# EAGLE design 4aw (EAGLE 9.6.2)
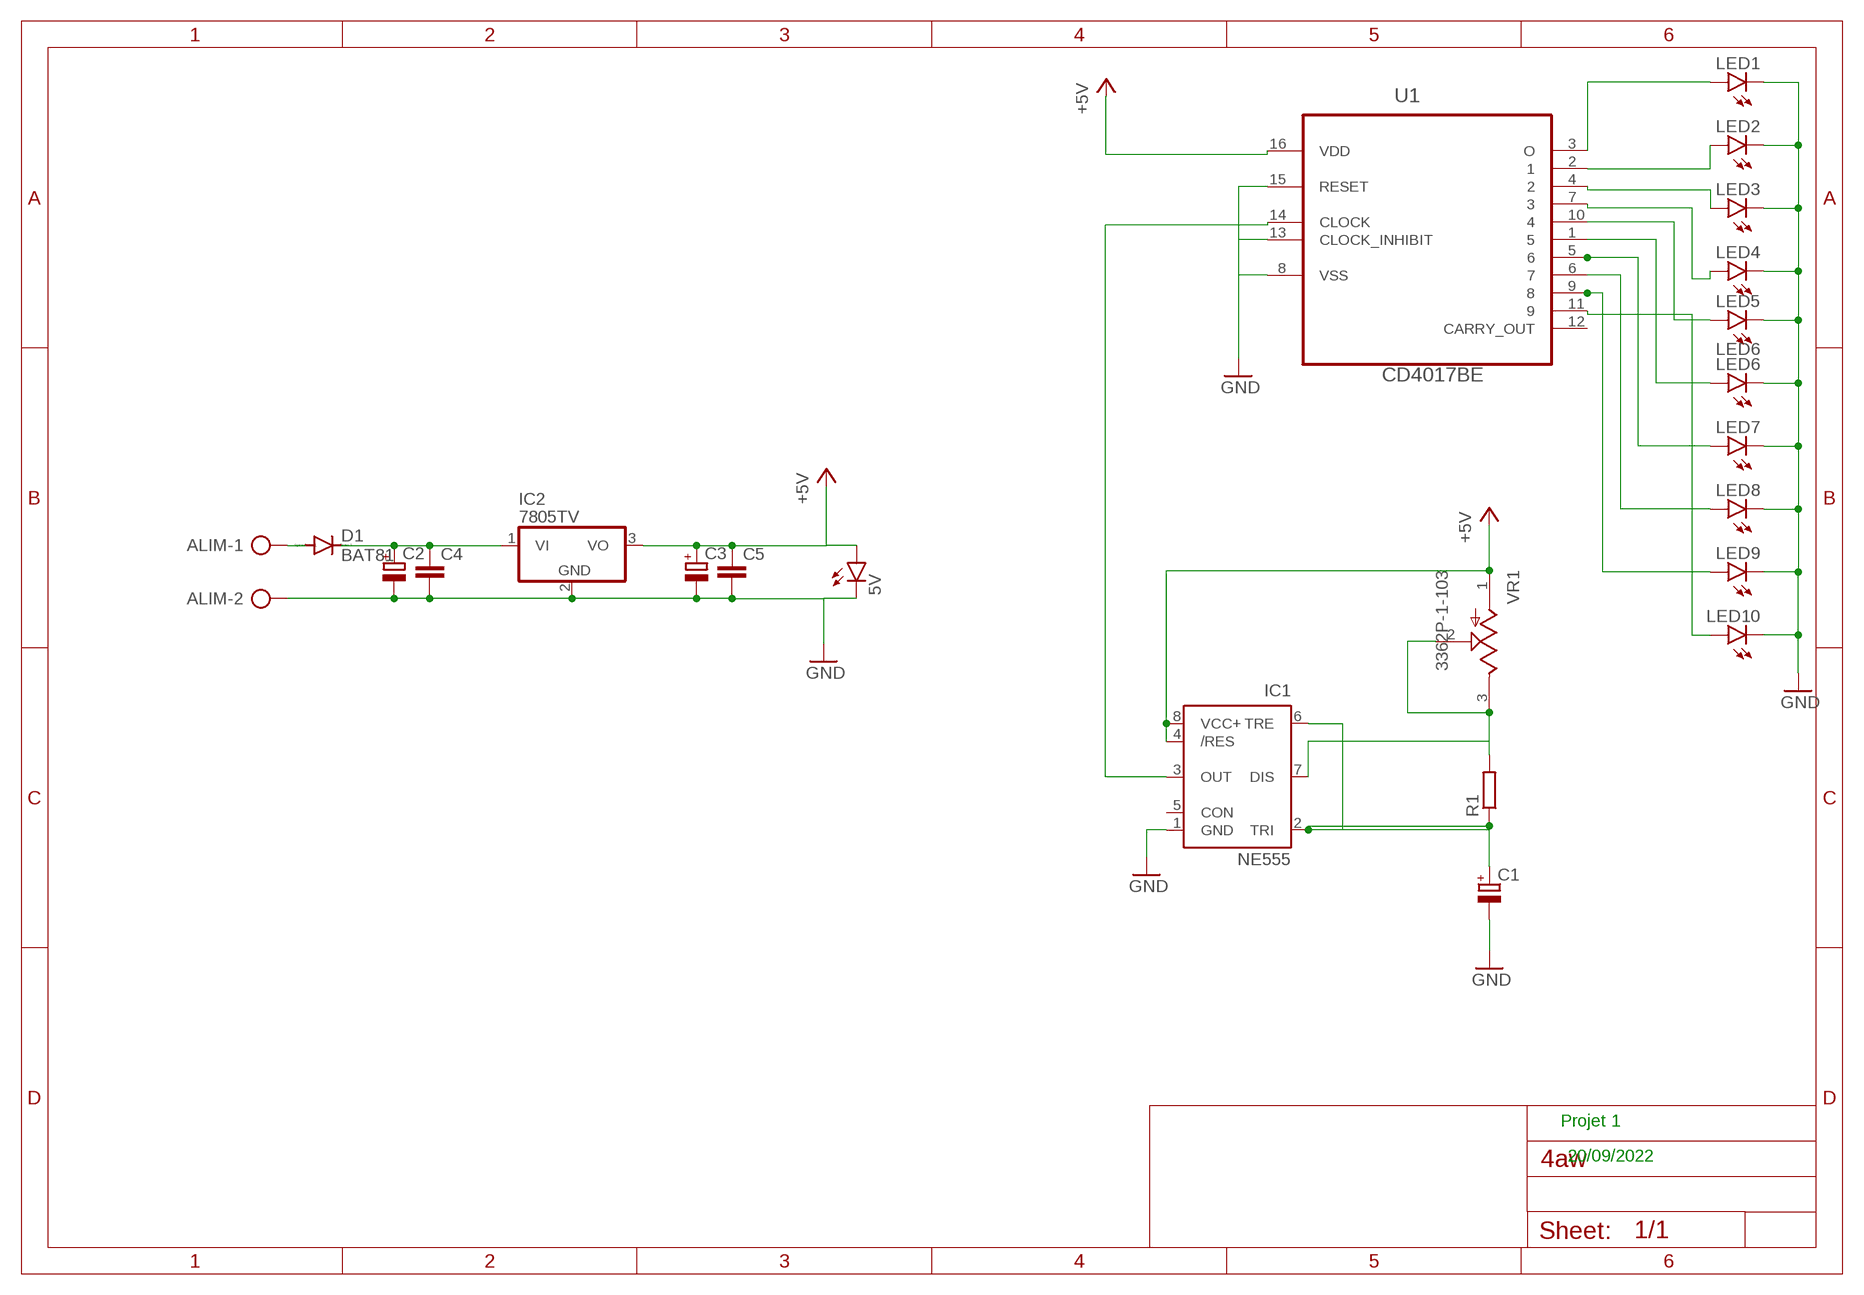
[diagram p0: schematic, sheet 1]

## Parts
5V  LED3MM  [LED3MM]
ALIM  AK500/2  [AK500/2]
C1  CPOL-EUE2.5-5  [E2,5-5]
C2  CPOL-EUE2.5-5  [E2,5-5]
C3  CPOL-EUE2.5-5  [E2,5-5]
C4  C-EU050-024X044  [C050-024X044]
C5  C-EU050-024X044  [C050-024X044]
D1  BAT81  [DO34-7]
IC1  NE555  [DIL-08]
IC2  7805TV  [TO220V]
LED1  LED5MM  [LED5MM]
LED2  LED5MM  [LED5MM]
LED3  LED5MM  [LED5MM]
LED4  LED5MM  [LED5MM]
LED5  LED5MM  [LED5MM]
LED6  LED6  LED5MM  [LED5MM]
LED7  LED5MM  [LED5MM]
LED8  LED5MM  [LED5MM]
LED9  LED5MM  [LED5MM]
LED10  LED5MM  [LED5MM]
R1  R-EU_0207/10  [0207/10]
U1  CD4017BE  [DIP254P762X508-16]
VR1  3362P-1-103  [TRIM_3362P-1-103]

## Nets
+5V: 5V.A C3.+ C5.1 IC1.4(/RES) IC1.8(VCC+) IC2.3(VO) U1.16(VDD) VR1.1(CCW)
GND: 5V.K(C) ALIM.2 C1.- C2.- C3.- C4.2 C5.2 IC1.1(GND) IC2.2(GND) LED1.K(C) LED2.K(C) LED3.K(C) LED4.K(C) LED5.K(C) LED6.K(C) LED7.K(C) LED8.K(C) LED9.K(C) LED10.K(C) U1.8(VSS) U1.13(CLOCK_INHIBIT) U1.15(RESET)
N$1: LED4.A U1.7
N$2: LED5.A U1.10
N$3: LED6.A U1.1
N$4: LED10.A U1.11
N$5: LED8.A U1.6
N$6: IC1.3(OUT) U1.14(CLOCK)
N$7: ALIM.1 D1.A
N$8: LED3.A U1.4
N$9: LED2.A U1.2
N$10: LED1.A U1.3(O)
N$11: C1.+ IC1.2(TRI) IC1.6(TRE) R1.1
N$12: C2.+ C4.1 D1.C IC2.1(VI)
N$13: LED7.A U1.5
N$14: IC1.7(DIS) R1.2 VR1.2(WIPER) VR1.3(CW)
N$15: LED9.A U1.9
Unconnected: IC1.5(CON) U1.12(CARRY_OUT)

## Notes on the sheet
- Projet 1
- 20/09/2022

## Library data of the parts
5V LED1-LED10 = led:LED: LED OSRAM: - CHIPLED LG R971, LG N971, LY N971, LG Q971, LY Q971, LO R971, LY R971 LH N974, LH R974 LS Q976, LO Q976, LY Q976 LO Q996 - Hyper CHIPLED LW Q18S LB Q993, LB Q99A, LB R99A - SideLED LS A670, LO A670, LY A670, LG A670, LP A670 LB A673, LV A673, LT A673, LW A673 LH A674 LY A675 LS A676, LA A676, LO A676, LY A676, LW A676 LS A679, LY A679, LG A679 - Hyper Micro SIDELED® LS Y876, LA Y876, LO Y876, LY Y876 LT Y87S - SmartLED LW L88C, LW L88S LB L89C, LB L89S, LG L890 LS L89K, LO L89K, LY L89K LS L896, LA L896, LO L896, LY L896 - TOPLED LS T670, LO T670, LY T670, LG T670, LP T670 LSG T670, LSP T670, LSY T670, LOP T670, LYG T670 LG T671, LOG T671, LSG T671 LB T673, LV T673, LT T673, LW T673 LH T674 LS T676, LA T676, LO T676, LY T676, LB T676, LH T676, LSB T676, LW T676 LB T67C, LV T67C, LT T67C, LS T67K, LO T67K, LY T67K, LW E67C LS E67B, LA E67B, LO E67B, LY E67B, LB E67C, LV E67C, LT E67C LW T67C LS T679, LY T679, LG T679 LS T770, LO T770, LY T770, LG T770, LP T770 LB T773, LV T773, LT T773, LW T773 LH T774 LS E675, LA E675, LY E675, LS T675 LS T776, LA T776, LO T776, LY T776, LB T776 LHGB T686 LT T68C, LB T68C - Hyper Mini TOPLED® LB M676 - Mini TOPLED Santana® LG M470 LS M47K, LO M47K, LY M47K Source: http://www.osram.convergy.de LUXEON: - LUMILED® LXK2-PW12-R00, LXK2-PW12-S00, LXK2-PW14-U00, LXK2-PW14-V00 LXK2-PM12-R00, LXK2-PM12-S00, LXK2-PM14-U00 LXK2-PE12-Q00, LXK2-PE12-R00, LXK2-PE12-S00, LXK2-PE14-T00, LXK2-PE14-U00 LXK2-PB12-K00, LXK2-PB12-L00, LXK2-PB12-M00, LXK2-PB14-N00, LXK2-PB14-P00, LXK2-PB14-Q00 LXK2-PR12-L00, LXK2-PR12-M00, LXK2-PR14-Q00, LXK2-PR14-R00 LXK2-PD12-Q00, LXK2-PD12-R00, LXK2-PD12-S00 LXK2-PH12-R00, LXK2-PH12-S00 LXK2-PL12-P00, LXK2-PL12-Q00, LXK2-PL12-R00 Source: www.luxeon.com KINGBRIGHT: KA-3528ASYC Source: www.kingbright.com
ALIM = con-ptr500:AK500/2: CONNECTOR; OC_FARNELL: unknown; OC_NEWARK: unknown
C1 = resistor:CPOL-EU: POLARIZED CAPACITOR, European symbol
C2 C3 = rcl:CPOL-EU: POLARIZED CAPACITOR, European symbol; SPICEPREFIX: C
C4 C5 = rcl:C-EU: CAPACITOR, European symbol; SPICEPREFIX: C
D1 = diode:BAT81: DIODE barrier diode
IC1 = st-microelectronics:NE555: General purpose bipolar Timer; MF: Arrow Electronics; MPN: NE555N; OC_FARNELL: 1467742; OC_NEWARK: 89K1486
IC2 = linear:78*: Positive VOLTAGE REGULATOR Source: http://cache.national.com/ds/LM/LM78L05.pdf http://www.fairchildsemi.com/ds/LM/LM7805.pdf
R1 = rcl:R-EU_: RESISTOR, European symbol; SPICEPREFIX: R
U1 = CD4017BE:CD4017BE: CMOS COUNTER/DIVIDERS Check availability <https://pricing.snapeda.com/parts/CD4017BE/Texas%20Instruments/view-part?ref=eda>; AVAILABILITY: In Stock; DESCRIPTION: CMOS Decade Counter with 10 Decoded Outputs; MF: Texas Instruments; MP: CD4017BE; PACKAGE: PDIP-16 Texas Instruments; PRICE: None; PURCHASE-URL: https://pricing.snapeda.com/search/part/CD4017BE/?ref=eda
VR1 = 3362P-1-103:3362P-1-103: Res Cermet Trimmer 50K Ohm 10% 1/2W 1(Elec)/1(Mech)Turn 2.77mm (6.6 X 6.99 X 4.7mm) Pin Thru-Hole Tube Check availability <https://pricing.snapeda.com/parts/3362P-1-103/Bourns/view-part?ref=eda>; AVAILABILITY: In Stock; DESCRIPTION: 10 kOhms 0.5W, 1/2W PC Pins Through Hole Trimmer Potentiometer Cermet 1.0 Turn Top Finger Adjustment; MF: Bourns; MP: 3362P-1-103; PACKAGE: 3362P-1 Bourns Inc.; PRICE: None; PURCHASE-URL: https://pricing.snapeda.com/search/part/3362P-1-103/?ref=eda

## Board
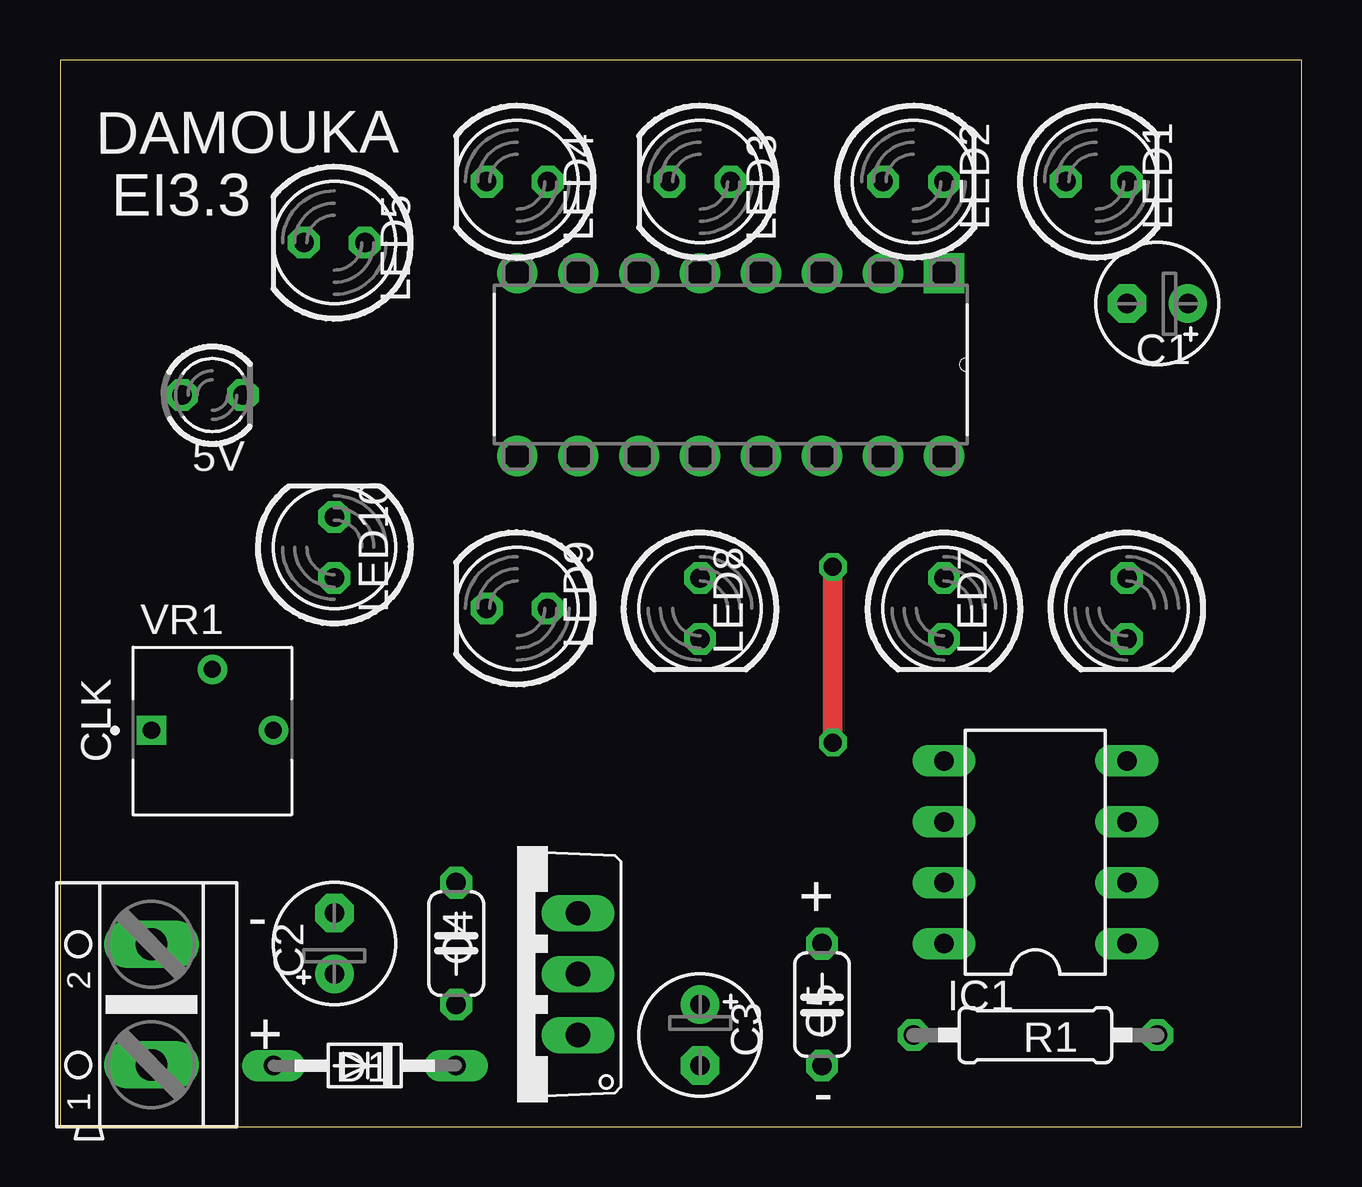
[diagram p1: board, top side]
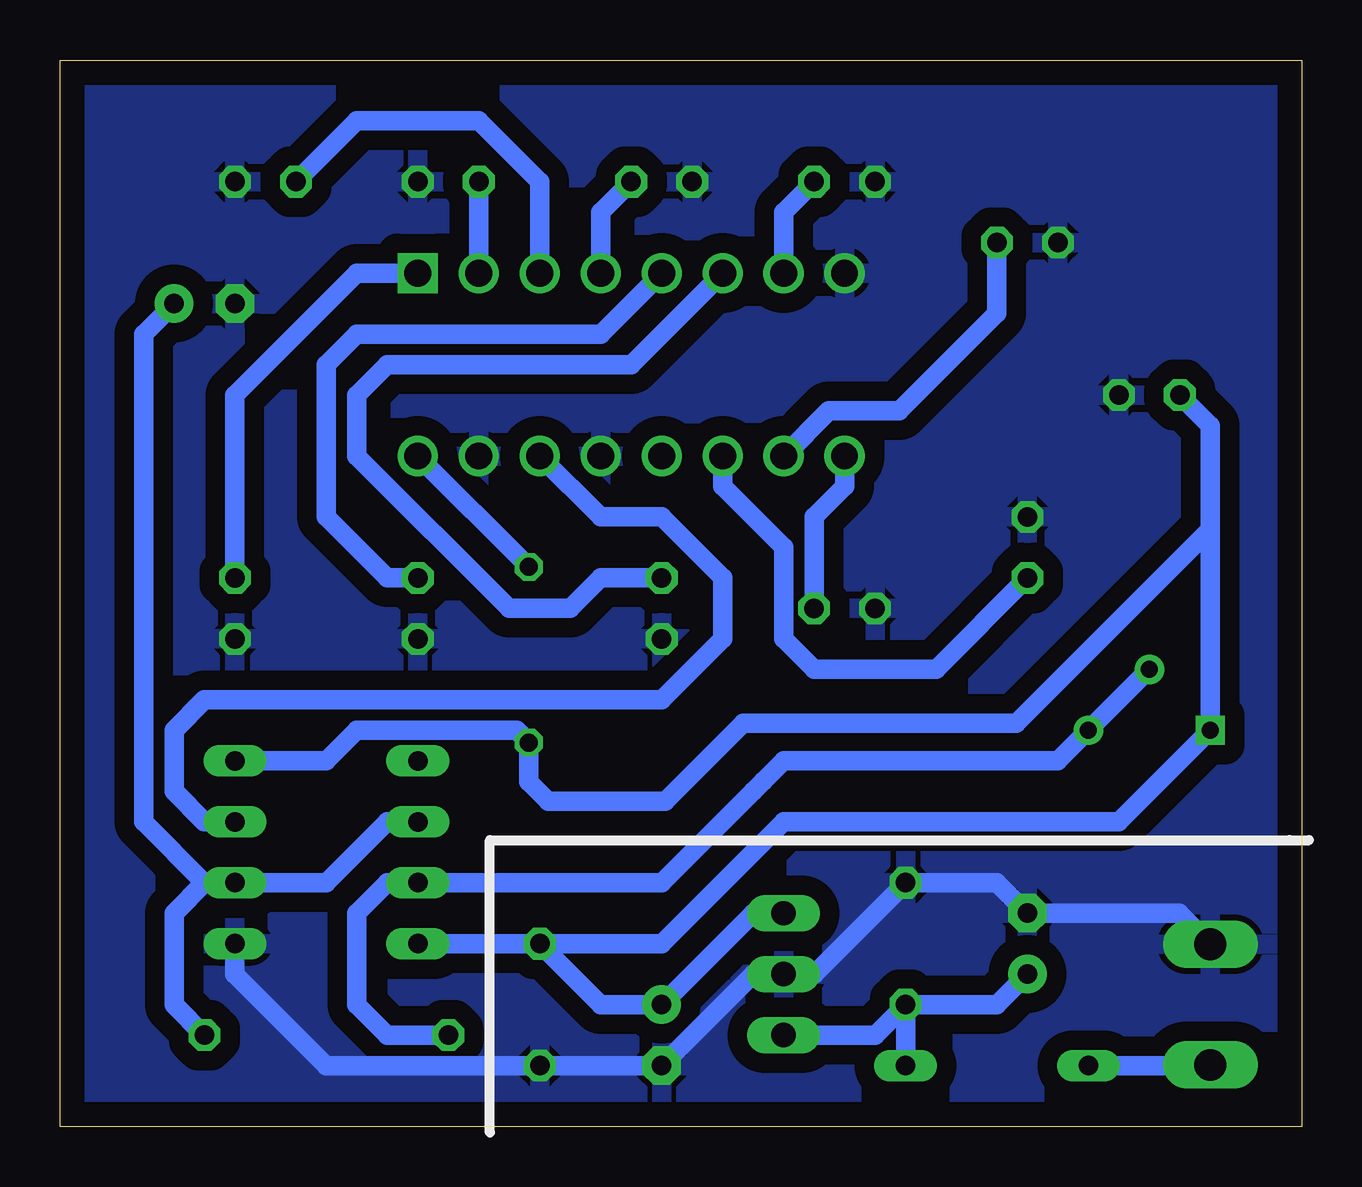
[diagram p2: board, bottom side, seen from below]

Size 51.74 x 44.44 mm. Coordinates in mm from the lower left corner, seen from the top.
Outline: 0,0 51.74,0 51.74,44.44 0,44.44 0,0
Copper layers (1*16): Top 0.035mm / dielectric 1.5mm / Bottom 0.035mm
Design rules "default": minimum track width 6mil, minimum drill 0.35mm, track to track 6mil, track to pad 6mil, pad to pad 6mil, via to via 6mil, smd to smd 6mil, copper to edge 40mil, drill to drill 6mil, minimum pad ring 10mil, minimum via ring 8mil, stop-mask expansion 4mil, vias tented up to drill 0mil, thermal gap 10mil

### Footprints (pad centres in the part's own frame; a part is rotated, then mirrored left to right if it is on the bottom)
LED3MM = drill 0.813 octagon: A -1.27,0; K 1.27,0
AK500/2 = drill 1.321 long: 1 -2.515,0; 2 2.515,0
E2,5-5 = drill 0.813 pad 1.6: + -1.27,0 | drill 0.813 pad 1.6 octagon: - 1.27,0
C050-024X044 = drill 0.813 octagon: 1 -2.54,0; 2 2.54,0
DO34-7 = drill 0.813 long: A 3.81,0; C -3.81,0
DIL-08 = drill 0.813 long: 1 -3.81,-3.81; 2 -1.27,-3.81; 3 1.27,-3.81; 4 3.81,-3.81; 5 3.81,3.81; 6 1.27,3.81; 7 -1.27,3.81; 8 -3.81,3.81
TO220V = drill 1.016 long: 1 -2.54,-2.54; 2 0,-2.54; 3 2.54,-2.54
LED5MM = drill 0.813 octagon: A -1.27,0; K 1.27,0
0207/10 = drill 0.813 octagon: 1 -5.08,0; 2 5.08,0
DIP254P762X508-16 = drill 1.118 square: 1 -7.62,17.78 | drill 1.118: 2 -7.62,15.24; 3 -7.62,12.7; 4 -7.62,10.16; 5 -7.62,7.62; 6 -7.62,5.08; 7 -7.62,2.54; 8 -7.62,0; 9 0,0; 10 0,2.54; 11 0,5.08; 12 0,7.62; 13 0,10.16; 14 0,12.7; 15 0,15.24; 16 0,17.78
TRIM_3362P-1-103 = drill 0.714 square: 1 -2.54,0 | drill 0.714: 2 0,2.54; 3 2.54,0

### Placement (x,y rotation side)
5V  6.35,30.48 0 top
ALIM  3.81,5.08 90 top
C1  45.72,34.29 180 top
C2  11.43,7.62 90 top
C3  26.67,3.81 270 top
C4  16.51,7.62 90 top
C5  31.75,5.08 270 top
D1  12.7,2.54 180 top
IC1  40.64,11.43 90 top
IC2  19.05,6.35 90 top
LED1  43.18,39.37 0 top
LED2  35.56,39.37 0 top
LED3  26.67,39.37 180 top
LED4  19.05,39.37 180 top
LED5  11.43,36.83 180 top
LED6  44.45,21.59 270 top
LED7  36.83,21.59 270 top
LED8  26.67,21.59 270 top
LED9  19.05,21.59 180 top
LED10  11.43,24.13 90 top
R1  40.64,3.81 180 top
U1  19.05,27.94 270 top
VR1  6.35,16.51 0 top

### Tracks (layer width: path | path; a pad name or v marks a point on that pad's centre or on a via)
+5V  (via drill 0.75)
  Top 0.813: v32.21,16 v32.21,23.32
  Bottom 0.813: IC2.3 22.86,8.89 C3.+ 29.21,5.08 C5.1 | C5.1 IC1.8 | IC1.4 40.64,15.24 39.37,16.51 32.72,16.51 v32.21,16 32.21,14.38 31.39,13.56 26.52,13.56 23.27,16.82 11.89,16.82 3.81,24.89 | C5.1 26.67,7.62 21.59,12.7 7.62,12.7 VR1.1 3.81,24.89 | 5V.A 3.81,29.21 3.81,24.89 | v32.21,23.32 U1.16
GND
  Bottom 0.813: ALIM.2 5.1,8.89 C2.- 12.7,10.16 C4.2 20.32,6.35 IC2.2 22.86,6.35 C3.- C5.2 40.64,2.54 44.45,6.35 IC1.1
  pour Bottom (isolate 0.813): 0,44.45 52.07,44.45 52.07,0 0,0
N$1
  Bottom 0.813: LED4.A 21.59,38.1 U1.7
N$2
  Bottom 0.813: LED5.A 12.7,33.88 16.76,29.82 19.71,29.82 U1.10
N$3
  Bottom 0.813: U1.1 39.37,35.56 44.45,30.48 LED6.A
N$4
  Bottom 0.813: U1.11 24.13,26.67 21.59,24.13 21.59,20.32 20.32,19.05 15.24,19.05 LED10.A
N$5
  Bottom 0.813: U1.6 27.94,31.75 38.1,31.75 39.37,30.48 39.37,27.94 33.02,21.59 30.48,21.59 29.21,22.86 LED8.A
N$6
  Bottom 0.813: IC1.3 45.72,12.7 46.99,13.97 46.99,16.51 45.72,17.78 26.67,17.78 24.13,20.32 24.13,22.86 26.67,25.4 29.21,25.4 U1.14
N$7
  Bottom 0.813: ALIM.1 3.83,2.54 D1.A
N$8
  Bottom 0.813: LED3.A 29.21,38.1 U1.4
N$9
  Bottom 0.813: U1.2 LED2.A
N$10
  Bottom 0.813: U1.3 31.75,39.37 34.29,41.91 39.37,41.91 LED1.A
N$11
  Bottom 0.813: 45.72,10.16 IC1.2 40.64,10.16 38.1,12.7 IC1.6 | R1.1 46.99,5.08 46.99,8.89 45.72,10.16 | C1.+ 48.26,33.02 48.26,12.7 45.72,10.16
N$12
  Bottom 0.813: C4.1 12.7,5.08 C2.+ | D1.C C4.1 | C4.1 17.78,3.81 IC2.1
N$13
  Bottom 0.813: LED7.A 38.1,22.86 40.64,25.4 40.64,31.75 39.37,33.02 29.21,33.02 U1.5
N$14
  Bottom 0.813: VR1.2 VR1.3 10.16,15.24 21.59,15.24 22.43,14.4 22.86,13.97 26.67,10.16 IC1.7 38.1,10.16 39.37,8.89 39.37,5.08 38.1,3.81 R1.2
N$15
  Bottom 0.813: LED9.A 20.32,25.4 19.05,26.67 U1.9

### Text on the board
tPlace: DAMOUKA | EI3.3 | CLK | + | - | + | -